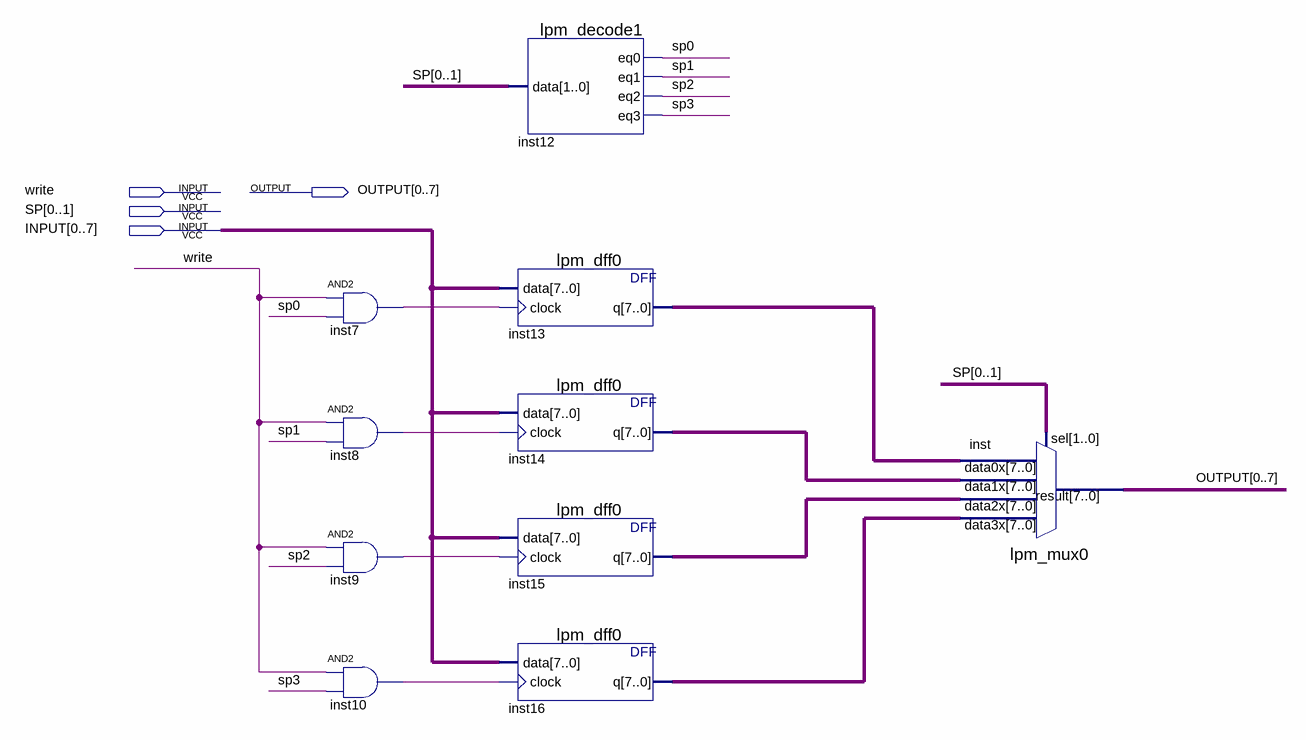
[diagram p0: schematic sheet]
// Quartus schematic STACK.bdf as structural Verilog: 10 symbols, 4 pins
module STACK (
  input  write,
  input  [0:1] SP,
  input  [0:7] INPUT,
  output [0:7] OUTPUT
);

  wire inst7_out, inst8_out, inst9_out, inst10_out, sp2, sp3;
  wire [7:0] inst13_q, inst14_q, inst15_q, inst16_q;

  and inst7 (inst7_out, write, SP[0]);
  and inst8 (inst8_out, write, SP[1]);
  and inst9 (inst9_out, write, sp2);
  and inst10 (inst10_out, write, sp3);
  lpm_decode1 inst12 (.data(SP), .eq0(SP[0]), .eq1(SP[1]), .eq2(sp2), .eq3(sp3));
  lpm_dff0 inst13 (.data(INPUT), .clock(inst7_out), .q(inst13_q));
  lpm_dff0 inst14 (.data(INPUT), .clock(inst8_out), .q(inst14_q));
  lpm_dff0 inst15 (.data(INPUT), .clock(inst9_out), .q(inst15_q));
  lpm_dff0 inst16 (.data(INPUT), .clock(inst10_out), .q(inst16_q));
  lpm_mux0 inst (.data3x(inst16_q), .data2x(inst15_q), .data1x(inst14_q), .data0x(inst13_q), .sel(SP), .result(OUTPUT));
endmodule
